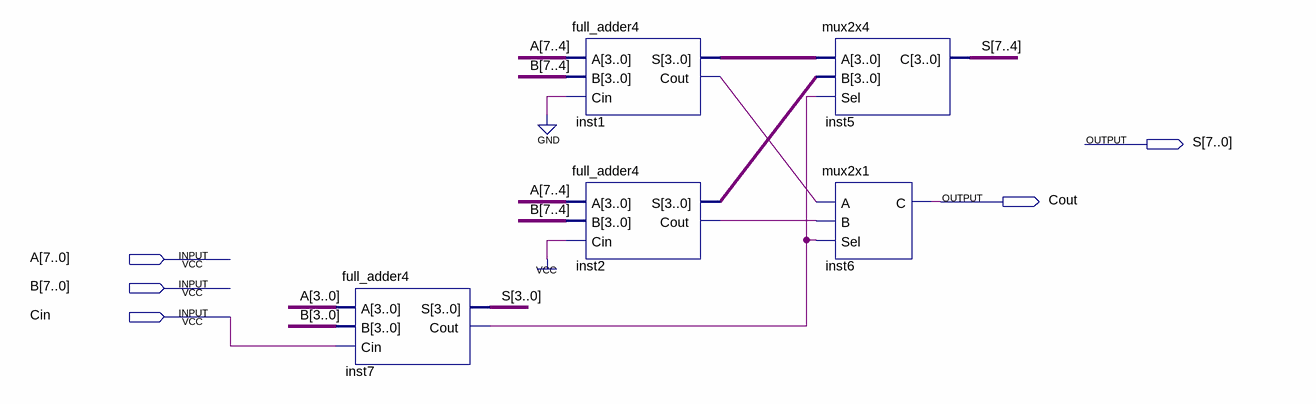
[diagram p0: schematic sheet]
// Quartus schematic full_adder8.bdf as structural Verilog: 5 symbols, 5 pins
module full_adder8 (
  input  [7:0] A,
  input  [7:0] B,
  input  Cin,
  output [7:0] S,
  output Cout
);

  wire inst1_cout, inst2_cout, inst7_cout;
  wire [3:0] inst1_s, inst2_s;

  full_adder4 inst7 (.A(A[3:0]), .B(B[3:0]), .Cin(Cin), .S(S[3:0]), .Cout(inst7_cout));
  full_adder4 inst1 (.A(A[7:4]), .B(B[7:4]), .Cin(1'b0), .S(inst1_s), .Cout(inst1_cout));
  full_adder4 inst2 (.A(A[7:4]), .B(B[7:4]), .Cin(1'b1), .S(inst2_s), .Cout(inst2_cout));
  mux2x4 inst5 (.A(inst1_s), .B(inst2_s), .Sel(inst7_cout), .C(S[7:4]));
  mux2x1 inst6 (.A(inst1_cout), .B(inst2_cout), .Sel(inst7_cout), .C(Cout));
endmodule
